# EAGLE design v1 (EAGLE 5.06)
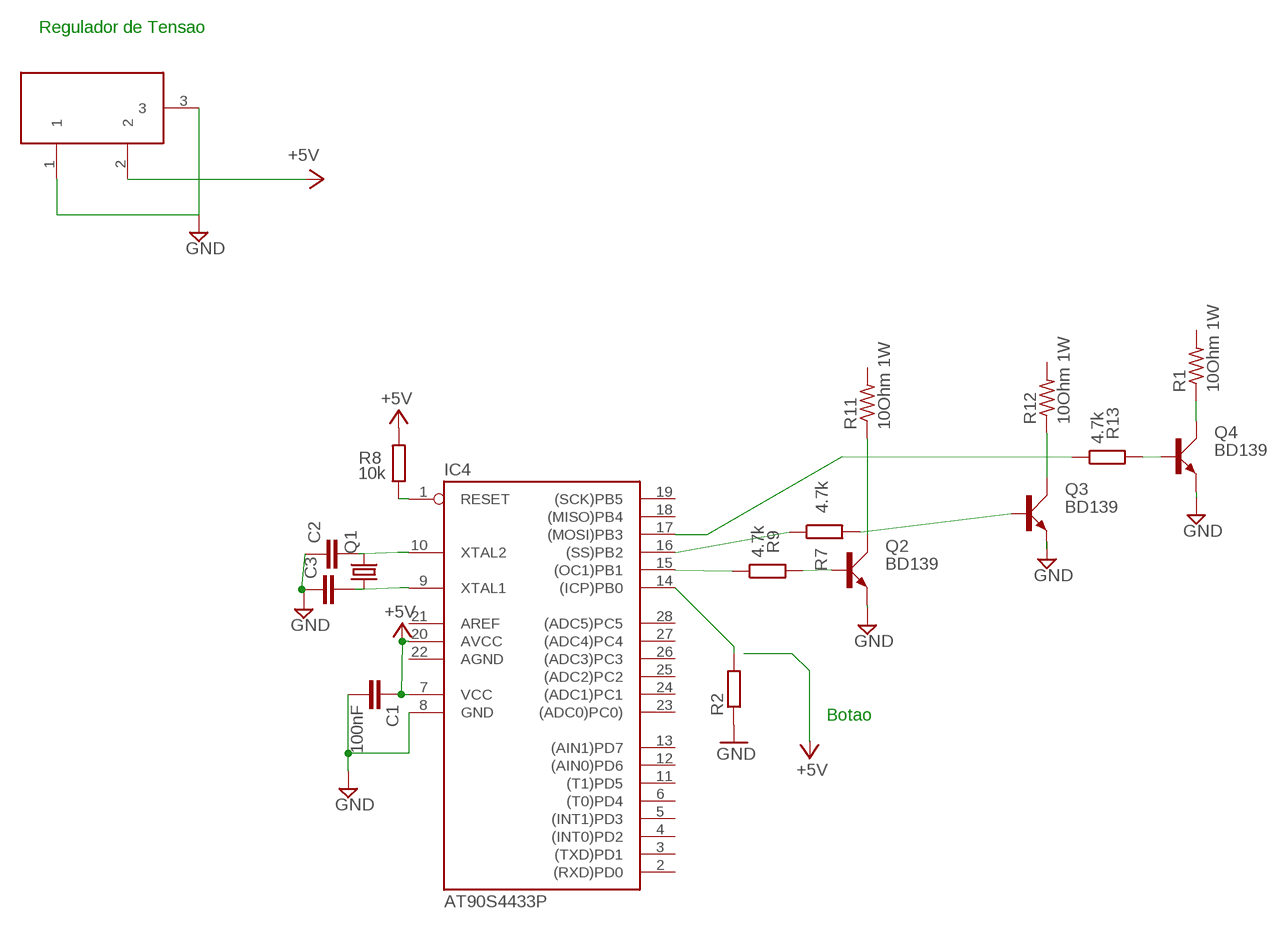
[diagram p0: schematic, sheet 1]

## Parts
C1  100nF  C2.5/2  [C2.5-2]
C2  C2.5/2  [C2.5-2]
C3  C2.5/2  [C2.5-2]
DC3  DC21MMX  [DC-21MM]
IC4  AT90S4433P  [DIL28-3]
Q1  CRYSTALHC49S  [HC49/S]
Q2  BD139  [TO126AV]
Q3  BD139  [TO126AV]
Q4  BD139  [TO126AV]
R1  10Ohm 1W  R-US_0207/10  [0207/10]
R2  R-EU_0204/7  [0204/7]
R7  4.7k  R-EU_0207/10  [0207/10]
R8  10k  R-EU_0207/10  [0207/10]
R9  4.7k  R-EU_0207/10  [0207/10]
R11  10Ohm 1W  R-US_0207/10  [0207/10]
R12  10Ohm 1W  R-US_0207/10  [0207/10]
R13  4.7k  R-EU_0207/10  [0207/10]

## Nets
N$1: IC4.15((OC1)PB1) R9.1
N$2: Q3.B R7.2
N$3: C3.2 IC4.9(XTAL1) Q1.1
N$4: IC4.14((ICP)PB0) R2.2
N$6: Q2.B R9.2
N$8: IC4.1(RESET) R8.1
N$9: C1.1 DC3.2 IC4.7(VCC) IC4.20(AVCC) R8.2 ; supply symbol labelled +5V
N$10: IC4.17((MOSI)PB3) R13.1
N$11: IC4.16((SS)PB2) R7.1
N$12: Q4.B R13.2
N$13: Q2.C R11.1
N$14: Q4.C R1.1
N$15: Q3.C R12.1
N$17: C2.2 IC4.10(XTAL2) Q1.2
N$31: C1.2 C2.1 C3.1 DC3.1 DC3.3 IC4.8(GND) Q2.E Q3.E Q4.E R2.1 ; supply symbol labelled GND
Unconnected: IC4.2((RXD)PD0) IC4.3((TXD)PD1) IC4.4((INT0)PD2) IC4.5((INT1)PD3) IC4.6((T0)PD4) IC4.11((T1)PD5) IC4.12((AIN0)PD6) IC4.13((AIN1)PD7) IC4.18((MISO)PB4) IC4.19((SCK)PB5) IC4.23((ADC0)PC0)) IC4.24((ADC1)PC1) IC4.25((ADC2)PC2) IC4.26((ADC3)PC3) IC4.27((ADC4)PC4) IC4.28((ADC5)PC5) R1.2 R11.2 R12.2

## Notes on the sheet
- Regulador de Tensao
- Botao

## Power pins joined to a net without a drawn wire
AGND: IC4.22(AGND)
AREF: IC4.21(AREF)

## Library data of the parts
C1-C3 = capacitor-wima:C: CAPACITOR naming: grid - package width
DC3 = powersupply:DC21MM
IC4 = atmel:AT90S4433: MICROCONTROLLER 4 Kbytes FLASH 128 bytes SRAM 256 bytes EEPROM UART 6-channel 10 bit ADC
Q1 = crystal:CRYSTAL: CRYSTAL
Q2-Q4 = transistor-power:BD139: NPN TRANSISTOR
R1 R11 R12 = resistor:R-US_: RESISTOR, American symbol
R2 R7-R9 R13 = rcl:R-EU_: RESISTOR, European symbol

## Net classes
1 power: width 0.61 mm

## Board
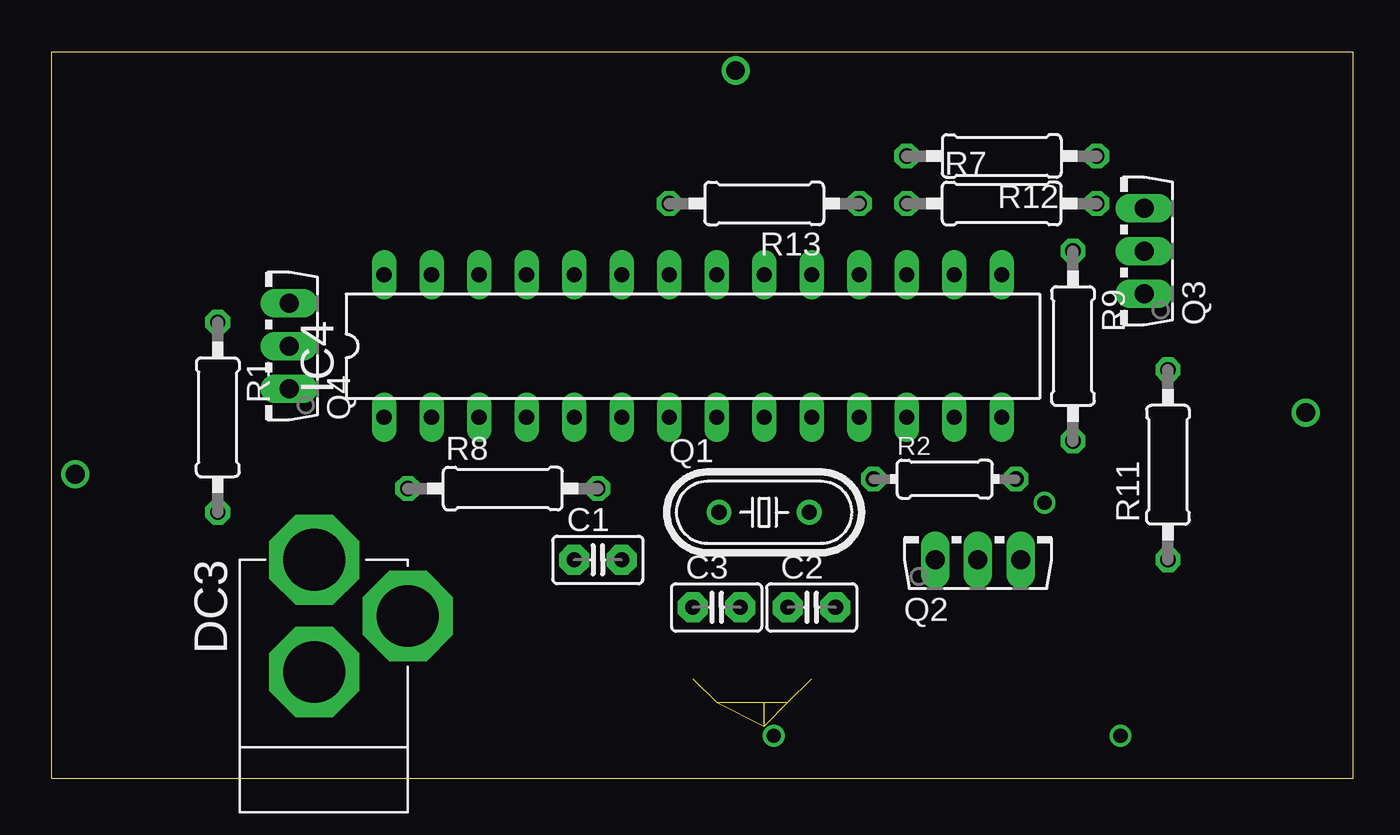
[diagram p1: board, top side]
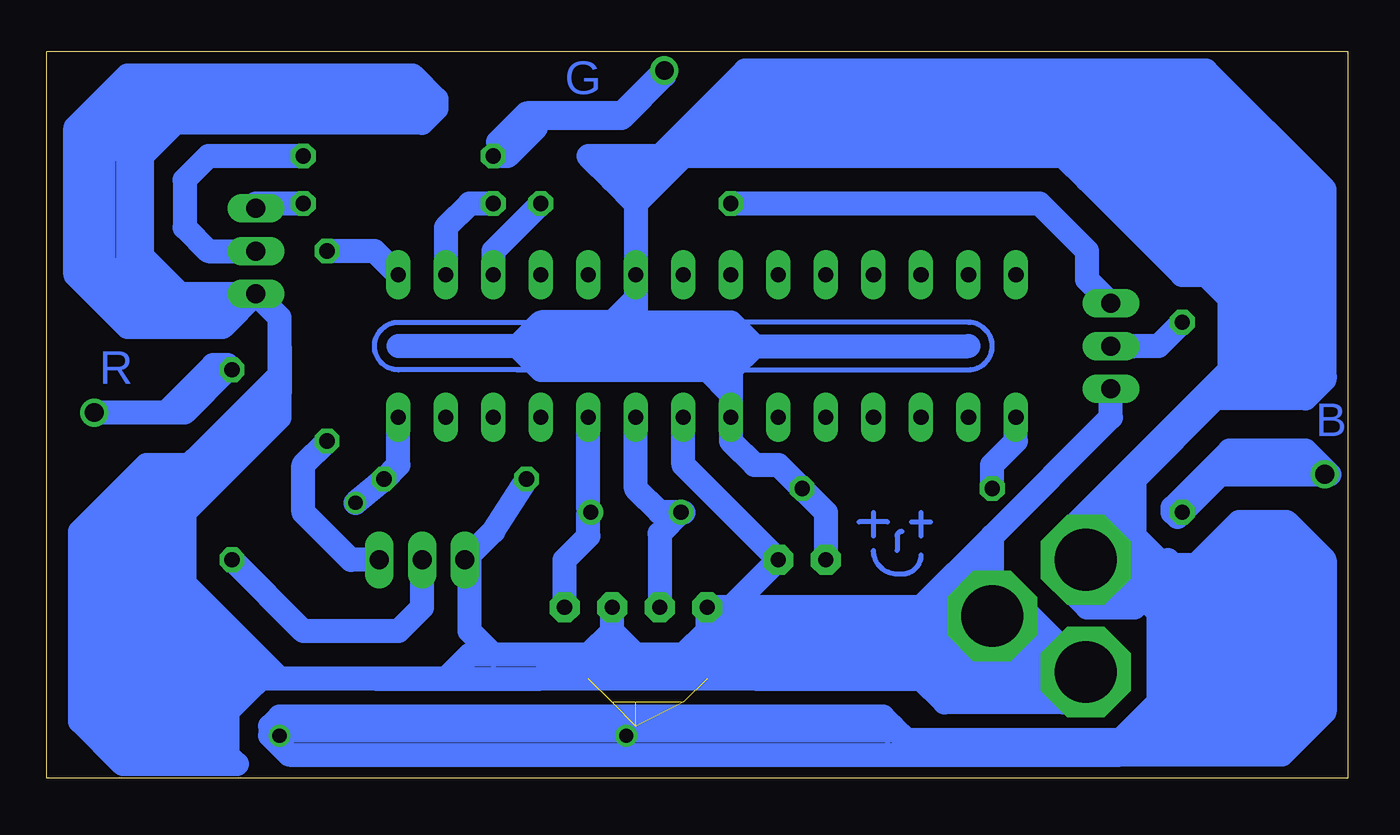
[diagram p2: board, bottom side, seen from below]

Size 69.6 x 38.86 mm. Coordinates in mm from the lower left corner, seen from the top.
Outline: 0,0 0,38.86 69.6,38.86 69.6,0 0,0
Copper layers (1*16): Top 0.035mm / dielectric 1.5mm / Bottom 0.035mm
Design rules "default": minimum track width 10mil, minimum drill 24mil, track to track 8mil, track to pad 8mil, pad to pad 8mil, via to via 8mil, smd to smd 8mil, copper to edge 40mil, drill to drill 8mil, minimum pad ring 10mil, minimum via ring 8mil, stop-mask expansion 4mil, vias tented up to drill 0mil, thermal gap 10mil

### Footprints (pad centres in the part's own frame; a part is rotated, then mirrored left to right if it is on the bottom)
C2.5-2 = drill 0.813 pad 1.6 octagon: 1 -1.27,0; 2 1.27,0
DC-21MM = drill 3.302 pad 4.826 octagon: 1 -5.08,-3.353; 2 -0.076,-6.35; 3 -0.076,-0.356
DIL28-3 = drill 0.813 long: 1 -16.51,-3.81; 2 -13.97,-3.81; 3 -11.43,-3.81; 4 -8.89,-3.81; 5 -6.35,-3.81; 6 -3.81,-3.81; 7 -1.27,-3.81; 8 1.27,-3.81; 9 3.81,-3.81; 10 6.35,-3.81; 11 8.89,-3.81; 12 11.43,-3.81; 13 13.97,-3.81; 14 16.51,-3.81; 15 16.51,3.81; 16 13.97,3.81; 17 11.43,3.81; 18 8.89,3.81; 19 6.35,3.81; 20 3.81,3.81; 21 1.27,3.81; 22 -1.27,3.81; 23 -3.81,3.81; 24 -6.35,3.81; 25 -8.89,3.81; 26 -11.43,3.81; 27 -13.97,3.81; 28 -16.51,3.81
HC49/S = drill 0.813 round: 1 -2.413,0; 2 2.413,0
TO126AV = drill 1.016 long: B 2.286,-1.27; C 0,-1.27; E -2.286,-1.27
0207/10 = drill 0.813 octagon: 1 -5.08,0; 2 5.08,0
0204/7 = drill 0.813 octagon: 1 -3.81,0; 2 3.81,0

### Placement (x,y rotation side)
C1  29.21,11.68 0 top
C2  40.64,9.14 0 top
C3  35.56,9.14 0 top
DC3  13.97,5.33 180 top
IC4  34.29,23.11 0 top
Q1  38.1,14.22 0 top
Q2  49.53,12.95 0 top
Q3  57.15,28.19 90 top
Q4  11.43,23.11 90 top
R1  8.89,19.3 270 top
R2  47.75,16 0 top
R7  50.8,30.73 0 top
R8  24.13,15.49 0 top
R9  54.61,23.11 270 top
R11  59.69,16.76 90 top
R12  50.8,33.27 180 top
R13  38.1,30.73 180 top

### Tracks (layer width: path | path; a pad name or v marks a point on that pad's centre or on a via)
N$1
  Bottom 1.27: IC4.15 52.07,28.19 R9.1
N$2
  Bottom 1.27: Q3.B 58.42,30.73 R7.2
N$3
  Bottom 1.27: IC4.9 38.1,15.49 36.83,14.22 Q1.1 | Q1.1 35.56,14.22 | Q1.1 36.83,13.08 C3.2
N$4  (via drill 0.76)
  Bottom 1.27: v53.09,14.73 R2.2 50.8,16.76 IC4.14
N$5
  Bottom 0.254: 22.86,14.22 22.86,12.95
N$6
  Bottom 1.27: Q2.B 53.34,11.68 55.88,14.22 55.88,16.76 R9.2
N$8
  Bottom 1.27: R8.1 19.05,16.76 17.78,18.03 IC4.1
N$9
  Bottom 0.254: 33.02,21.84 20.32,21.84 arc-90 19.05,23.11 arc-90 20.32,24.38 33.02,24.38 | 44.45,21.84 43.18,21.84 50.8,21.84 arc90 52.07,23.11 arc90 50.8,24.38 43.18,24.38
  Bottom 1.27: 36.83,23.11 34.29,23.11 33.02,21.84 | 33.02,20.57 IC4.7 33.02,18.03 31.75,16.76 30.48,16.76 R8.2 27.94,14.22 C1.1 | 33.02,21.84 33.02,20.57 | 38.1,24.38 39.37,23.11 | 38.1,25.65 38.1,24.38 | 38.1,25.65 IC4.20 38.1,30.73 | 38.1,25.65 39.37,24.38 43.18,24.38 44.45,23.11 | 44.45,23.11 43.18,21.84 34.29,21.84 | 33.02,21.84 34.29,21.84 | 31.75,23.11 33.02,21.84 | 31.75,23.11 33.02,24.38 38.1,24.38 | 38.1,24.38 36.83,23.11 | 36.83,23.11 33.02,23.11 | 36.83,23.11 43.18,23.11 | 33.02,20.57 34.29,21.84 | DC3.2 11.43,14.3 11.43,16.51 | 11.43,16.51 11.43,16.76 | 11.43,16.76 6.35,21.84 6.35,25.65 | 6.35,26.92 6.35,28.19 11.43,33.27 12.7,33.27 | 12.7,33.27 15.24,33.27 | 15.24,33.27 35.56,33.27 | 35.56,33.27 36.83,32 | 36.83,32 38.1,30.73 | 11.43,16.76 12.7,15.49 | 12.7,15.49 15.24,12.95 15.24,10.41 13.97,9.14 11.43,9.14 10.16,10.41 10.16,11.68 11.43,12.95 11.43,14.22 12.7,15.49 | 12.7,15.49 13.97,14.22 13.97,11.68 | 13.97,11.68 12.7,12.95 | 12.7,12.95 12.7,14.22 13.97,12.95 13.97,11.68 | 13.97,11.68 13.97,10.41 11.43,10.41 11.43,11.68 | 13.97,11.68 11.43,11.68 | 11.43,11.68 12.7,12.95 | 15.24,33.27 13.97,32 | 13.97,32 8.89,26.92 7.62,26.92 | 7.62,26.92 6.35,26.92 | 6.35,26.92 6.35,25.65 | 6.35,25.65 7.62,26.92 | 7.62,26.92 12.7,32 12.7,33.27 | 13.97,32 12.7,33.27 | 12.7,33.27 7.62,28.19 7.62,26.92 | 38.1,30.73 39.37,32 | 39.37,32 39.37,33.27 38.35,33.27 | 35.56,33.27 35.81,33.27 | 38.35,33.27 40.64,33.27 39.37,32 | 39.37,32 36.83,32 | 31.75,23.11 20.32,23.11 | 44.45,23.11 50.8,23.11 | 11.43,16.51 6.6,21.34 1.27,21.34 | 1.27,21.34 1.27,31.5 7.62,37.85 32.26,37.85 36.83,33.27 38.35,33.27 | 38.35,33.27 35.81,33.27 | 35.81,33.27 34.8,34.29 11.43,34.29 5.33,28.19 5.33,22.1 1.78,22.1 1.27,21.59 1.27,21.34
  Bottom 1.27: 1.27,21.34 2.29,20.32 7.11,20.32 11.43,16 11.68,16
N$10
  Bottom 1.27: R13.1 45.72,28.19 IC4.17
N$11
  Bottom 1.27: R7.1 46.99,30.73 48.26,29.46 IC4.16
N$12
  Bottom 1.27: Q4.B 13.97,26.67 13.97,28.19 16.51,30.73 R13.2
N$13
  Bottom 1.27: Q2.C 49.53,9.14 50.8,7.87 55.88,7.87 R11.1
N$14
  Bottom 1.27: 11.43,23.11 Q4.C 10.16,23.11 R1.1
N$15
  Bottom 1.27: R12.1 60.96,33.27 62.23,32 62.23,29.46 60.96,28.19 Q3.C
N$16
  Bottom 1.27: 36.58,37.59 38.86,35.31 43.18,35.31
N$17
  Bottom 1.27: C2.2 41.91,11.68 40.64,12.95 40.64,14.22 Q1.2 40.64,14.35 IC4.10
N$18
  Bottom 0.254: 25.4,14.22 25.4,12.95
N$19
  Bottom 0.254: 22.86,11.94 arc90 23.88,10.92 24.13,10.92 arc90 25.4,12.19
N$20
  Bottom 0.254: 24.64,13.72 26.16,13.72
N$21
  Bottom 0.254: 23.37,13.72 22.35,13.72
N$22
  Bottom 0.254: 23.88,13.21 arc-90 24.13,12.95 24.13,12.19
N$24  (via drill 1)
  Bottom 1.27: 9.14,13.97 6.86,16.26 v1.27,16.26 1.02,16.26 2.29,17.53 6.35,17.53 9.4,14.48 9.4,14.22
N$26  (via drill 1)
  Bottom 1.27: v36.58,37.85 38.86,35.56 43.94,35.56 45.47,34.04 45.47,33.27 44.96,33.27 43.43,34.8
N$27  (via drill 1)
  Bottom 1.27: 59.94,22.1 60.71,22.1 63.25,19.56 v67.06,19.56 62.23,19.56 59.94,21.84
N$28  (via drill 0.76)
  other vias: 57.15,2.29
N$29  (via drill 0.76)
  other vias: 38.61,2.29
N$30
  Bottom 1.27: 13.72,7.11 14.22,7.11
N$31  (7 unrouted)
  Bottom 1.27: 58.42,5.08 59.94,3.56 59.94,1.27 59.44,0.76 65.53,0.76 67.82,3.05 67.82,9.4 | DC3.3 17.5,9.14 17.78,9.14 | 17.78,9.14 19.05,9.14 | DC3.1 19.05,9.14 | 19.05,9.14 19.05,10.41 | 19.05,10.41 19.05,11.68 | 19.05,11.68 19.05,12.95 | 19.05,12.95 12.7,19.3 Q4.E | IC4.8 35.56,16.76 C1.2 33.02,9.14 C3.1 | C3.1 34.29,7.87 | 34.29,7.87 35.56,6.6 38.1,6.6 39.37,7.87 | 39.37,7.87 C2.1 | 39.37,7.87 40.64,6.6 | 40.64,6.6 45.72,6.6 | 45.72,6.6 46.99,7.87 46.99,11.68 Q2.E 45.72,13.21 R2.1 | 57.15,20.57 57.15,19.3 62.23,14.22 62.23,10.41 57.15,5.33 56.39,5.33 | 57.15,23.11 57.15,24.64 Q3.E 60.2,24.13 65.28,24.13 68.07,26.92 68.07,34.8 65.28,37.59 50.04,37.59 48.77,36.32 48.77,35.81 49.53,35.05 62.74,35.05 64.52,33.27 64.52,27.94 62.48,25.91 58.67,25.91 59.69,24.89 60.71,24.89 60.96,25.15 62.74,25.15 62.99,24.89 64.52,24.89 67.06,27.43 67.06,34.54 65.02,36.58 50.04,36.58 49.53,36.07 49.53,35.81 49.78,36.07 62.99,36.07 65.28,33.78 65.28,26.92 64.01,25.65 63.75,25.65 65.28,27.18 66.29,27.18 66.55,27.43 66.55,33.27 64.26,35.56 64.26,35.81 | 52.07,5.33 48.26,5.33 46.99,6.6 45.72,6.6 | 52.07,5.33 56.39,5.33 | 19.05,12.95 22.86,9.14 | 22.86,9.14 C3.1 | 19.05,9.14 20.32,7.87 | 20.32,7.87 34.29,7.87 | 34.29,7.87 31.75,5.33 | 31.75,5.33 22.86,5.33 | 22.86,5.33 13.97,5.33 | 31.75,5.33 34.29,5.33 40.64,5.33 43.18,5.33 | 52.07,5.33 43.18,5.33 | 43.18,5.33 41.91,6.6 40.64,6.6 | 40.64,6.6 17.27,6.6 | 17.27,6.6 15.24,6.6 | 15.24,6.6 17.78,9.14 | 17.78,9.14 19.05,7.87 | 17.78,7.87 19.05,7.87 | 19.05,7.87 20.32,7.87 | 19.05,11.68 21.59,9.14 22.86,9.14 | 22.86,9.14 20.32,9.14 19.05,10.41 | 15.24,6.6 13.97,6.6 | 13.97,6.6 12.7,6.6 12.7,5.33
  Bottom 1.27: 12.7,5.33 13.97,4.06 15.24,4.06 | 15.24,4.06 13.97,5.33 | 13.97,5.33 12.7,5.33 | 12.7,5.33 13.97,6.6 | 13.97,6.6 15.24,5.33 15.24,4.06 | 15.24,4.06 21.59,4.06 22.86,5.33 | 56.39,5.33 64.26,5.33 67.82,8.89 67.82,9.4 | 67.82,9.4 67.82,13.21 64.26,16.76 60.2,16.76 60.45,17.02 61.72,17.02 57.15,21.59 57.15,23.11 | 57.15,23.11 57.15,20.57 | 57.15,20.57 61.98,15.75 63.75,15.75 66.8,12.7 67.31,12.7 67.31,9.4 64.01,6.1 58.93,6.1 62.74,9.91 62.74,14.73 62.99,14.99 66.55,11.43 66.55,9.65 63.5,6.6 62.99,6.6 | 62.99,6.6 60.96,6.6 63.5,9.14 63.5,13.72 65.79,11.43 65.79,10.92 63.25,8.38 63.25,7.11 65.02,8.89 65.02,9.65 65.53,10.16 65.53,10.41 64.77,11.18 | 64.77,11.18 64.26,11.18 64.01,11.43 64.01,11.94 64.77,11.18 | 64.77,11.18 64.77,9.65 | 17.27,6.6 17.02,6.86 17.02,7.37 18.54,8.89 18.54,9.65 18.03,9.65 | 67.82,9.4 66.8,8.38 66.8,4.83 66.55,4.57 66.55,3.05 65.28,1.78 60.71,1.78 60.45,2.03 60.45,4.83 59.69,4.83 60.96,6.1 66.04,6.1 66.04,3.56 65.02,2.54 61.21,2.54 61.21,4.57 61.47,4.32 65.28,4.32 | 65.28,4.32 65.28,5.08 | 65.28,4.32 65.28,3.56 61.47,3.56 | 61.98,7.87 62.99,6.86 62.99,6.6
N$32
  Bottom 1.27: 9.65,11.68 9.4,11.43 8.13,11.43 5.84,13.72 3.3,13.72 1.27,11.68 1.27,3.56 3.56,1.27 12.45,1.27 | 10.67,9.4 10.16,8.89 10.16,4.06 12.19,2.03 23.62,2.03 24.38,2.79 | 24.38,2.79 24.89,3.3 57.15,3.3 57.66,2.79 57.66,2.29 56.64,1.27 12.45,1.27 | 12.45,1.27 12.19,1.27 9.65,3.81 9.65,11.43 | 24.38,2.79 24.64,2.54 56.9,2.54 | 12.45,1.27 11.43,2.29 3.81,2.29 2.29,3.81 2.29,11.18 4.06,12.95 4.06,13.21 4.32,12.95 5.08,12.95 7.37,10.67 8.64,10.67 8.89,10.41 8.89,8.64 9.14,8.38 9.14,3.3 4.32,3.3 2.79,4.83 3.3,5.33 3.3,11.43 4.06,12.19 4.57,12.19 6.86,9.91 7.62,9.91 8.13,9.4 8.13,8.89 8.38,8.64 8.38,4.32 8.13,4.57 4.57,4.57 4.06,5.08 4.06,11.18 6.35,8.89 7.37,8.89 7.62,8.64 7.62,6.35 7.37,6.1 7.37,5.33 7.11,5.59 5.84,5.59 4.83,6.6 4.83,9.14 5.33,8.64 5.33,6.35 5.08,6.1 5.08,5.33 6.35,6.6 6.6,6.6 6.1,7.11 6.1,7.37 | 6.1,8.64 6.1,7.37 | 6.1,7.37 6.86,8.13 6.86,8.38 7.11,8.13 7.11,7.62
N$33
  Bottom 1.27: 2.03,22.86 2.29,23.11 2.29,30.99 8.38,37.08 31.75,37.08 33.78,35.05 11.43,35.05 4.57,28.19 4.83,27.94 4.83,22.86 4.57,22.61 3.05,22.61 3.3,22.86 3.3,31.75 7.62,36.07 32,36.07 31.24,35.31 8.13,35.31 4.32,31.5 4.32,23.11 5.08,23.88 5.08,30.73 8.89,34.54 8.89,34.8 10.16,34.8 5.84,30.48 5.84,30.23

### Text on the board
Bottom: G | R | B